# Altium project ProjetX.PrjPcb
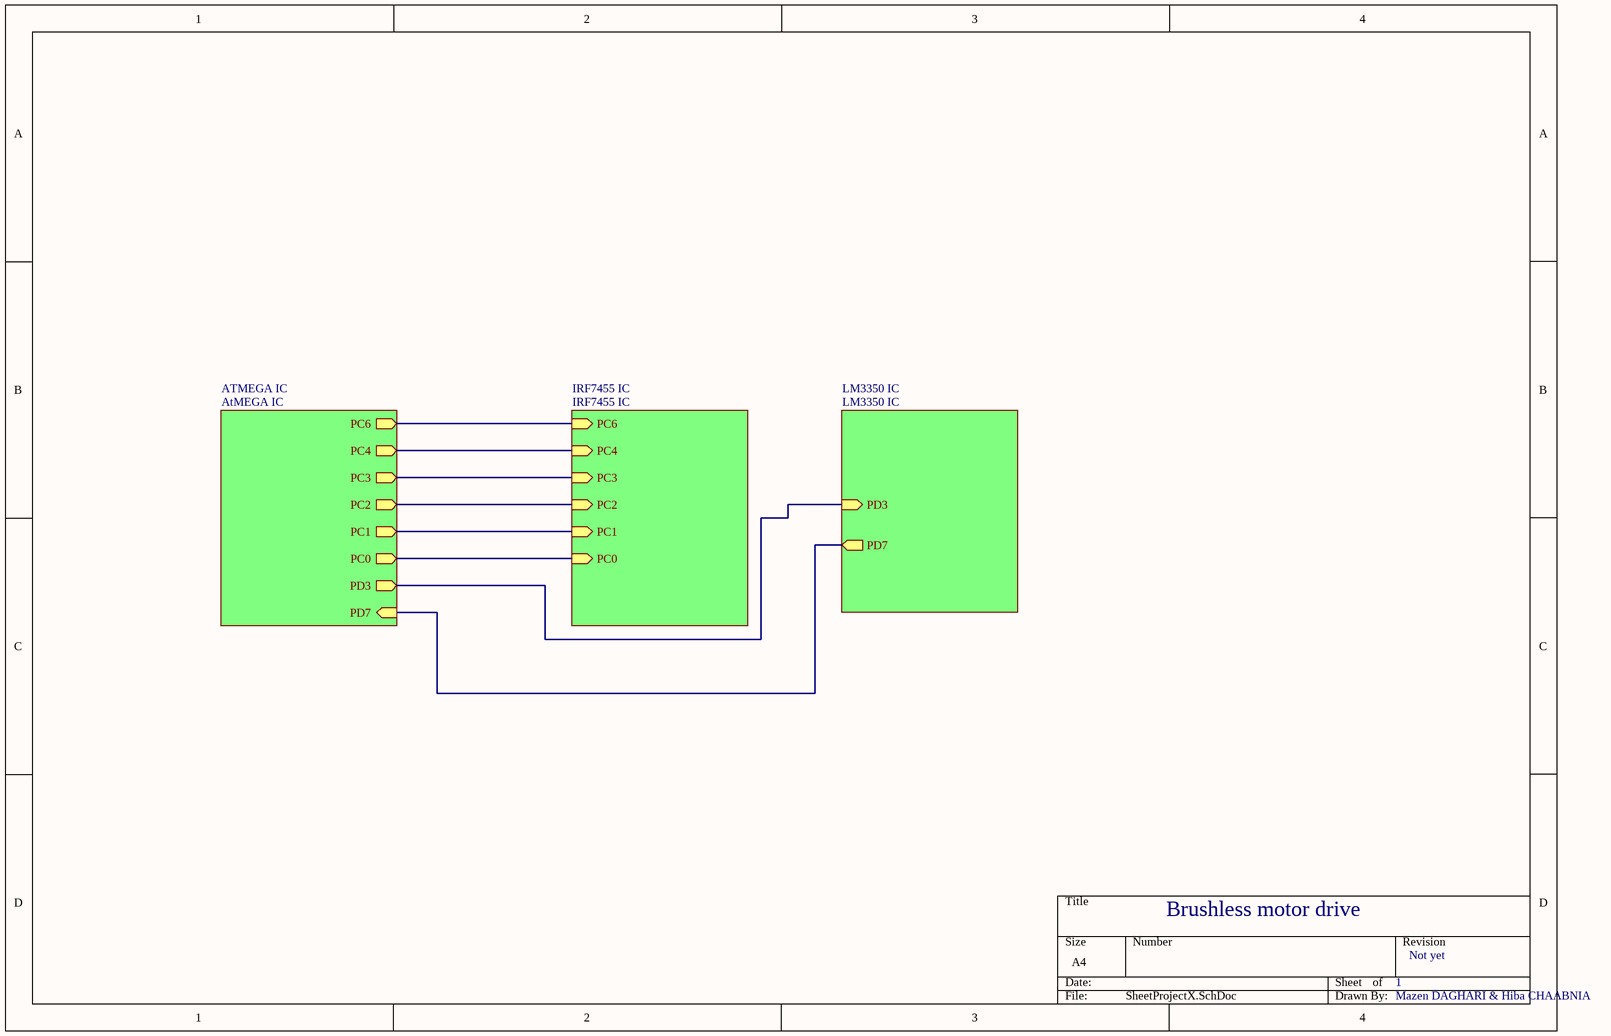
[diagram p0: SheetProjectX.SchDoc]
4 sheets, 57 parts. Net scope: hierarchical (ports join the sheet entries above them; power ports are global).
Board file: PCB3.PcbDoc
Sheets:
  SheetProjectX.SchDoc
    IRF7455 IC = IRF7455 IC.SchDoc
    LM3350 IC = LM3350 IC.SchDoc
    ATMEGA IC = AtMEGA IC.SchDoc

## Sheet SheetProjectX.SchDoc
size A4

### Sub-sheets
ATMEGA IC = AtMEGA IC: PC6 (out), PC4 (out), PC3 (out), PC2 (out), PC1 (out), PC0 (out), PD3 (out), PD7 (in)
IRF7455 IC = IRF7455 IC: PC1 (in), PC6 (in), PC4 (in), PC3 (in), PC2 (in), PC0 (in)
LM3350 IC = LM3350 IC: PD3 (in), PD7 (out)

### Nets
NetC2_18: sheet IRF7455 IC/PC6, sheet ATMEGA IC/PC6
NetC2_20: sheet IRF7455 IC/PC4, sheet ATMEGA IC/PC4
NetC2_21: sheet IRF7455 IC/PC3, sheet ATMEGA IC/PC3
NetC2_22: sheet IRF7455 IC/PC2, sheet ATMEGA IC/PC2
NetC2_23: sheet IRF7455 IC/PC1, sheet ATMEGA IC/PC1
NetC2_24: sheet IRF7455 IC/PC0, sheet ATMEGA IC/PC0
NetC2_31: sheet LM3350 IC/PD3, sheet ATMEGA IC/PD3
NetC4_2: sheet LM3350 IC/PD7, sheet ATMEGA IC/PD7

### Notes on the sheet
- Brushless motor drive
- 1
- Not yet
- Mazen DAGHARI & Hiba CHAABNIA

## Sheet IRF7455 IC.SchDoc
size A4
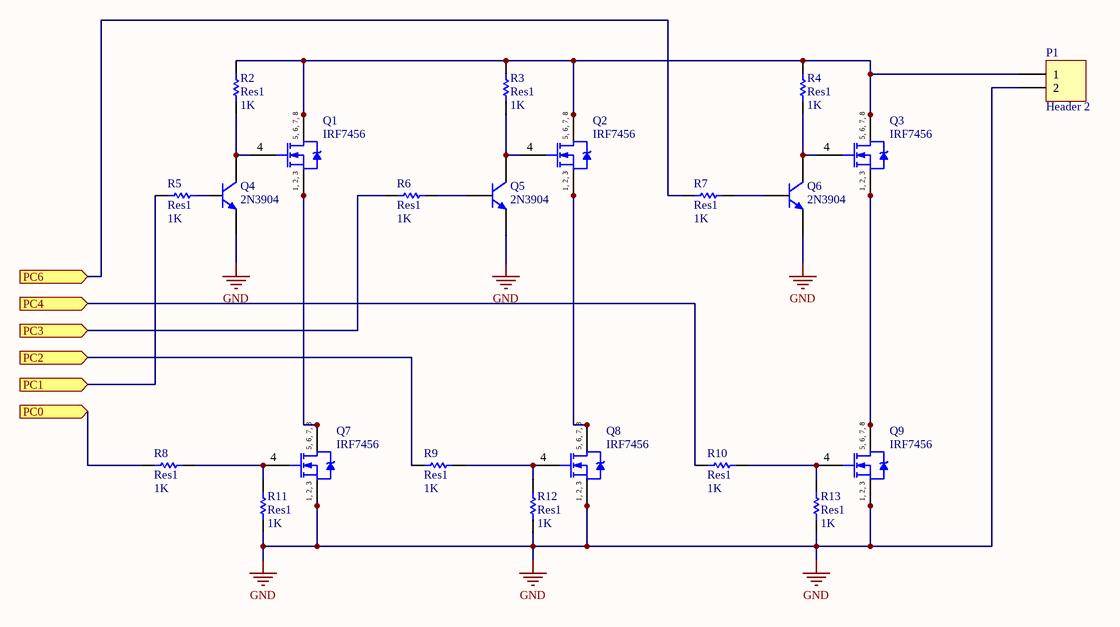
[diagram p1: IRF7455 IC.SchDoc]

### Parts
P1  Header 2  [HDR1X2]
Q1  IRF7456  [SO-8_N]
Q2  IRF7456  [SO-8_N]
Q3  IRF7456  [SO-8_N]
Q4  2N3904  [TO-92A]
Q5  2N3904  [TO-92A]
Q6  2N3904  [TO-92A]
Q7  IRF7456  [SO-8_N]
Q8  IRF7456  [SO-8_N]
Q9  IRF7456  [SO-8_N]
R2  Res1  value 1K  [AXIAL-0.3]
R3  Res1  value 1K  [AXIAL-0.3]
R4  Res1  value 1K  [AXIAL-0.3]
R5  Res1  value 1K  [AXIAL-0.3]
R6  Res1  value 1K  [AXIAL-0.3]
R7  Res1  value 1K  [AXIAL-0.3]
R8  Res1  value 1K  [AXIAL-0.3]
R9  Res1  value 1K  [AXIAL-0.3]
R10  Res1  value 1K  [AXIAL-0.3]
R11  Res1  value 1K  [AXIAL-0.3]
R12  Res1  value 1K  [AXIAL-0.3]
R13  Res1  value 1K  [AXIAL-0.3]

### Ports
PC0 (in), PC1 (in), PC2 (in), PC3 (in), PC4 (in), PC6 (in)

### Nets
GND: P1.2 Q4.1(E) Q5.1(E) Q6.1(E) Q7.1(S) Q7.2(S) Q7.3(S) Q8.1(S) Q8.2(S) Q8.3(S) Q9.1(S) Q9.2(S) Q9.3(S) R11.1 R12.1 R13.1
NetC2_18: R7.2 ; port PC6
NetC2_20: R10.2 ; port PC4
NetC2_21: R6.2 ; port PC3
NetC2_22: R9.2 ; port PC2
NetC2_23: R5.2 ; port PC1
NetC2_24: R8.2 ; port PC0
NetP1_1: P1.1 Q1.5(D) Q1.6(D) Q1.7(D) Q1.8(D) Q2.5(D) Q2.6(D) Q2.7(D) Q2.8(D) Q3.5(D) Q3.6(D) Q3.7(D) Q3.8(D) R2.2 R3.2 R4.2
NetQ1_1: Q1.1(S) Q1.2(S) Q1.3(S) Q7.5(D) Q7.6(D) Q7.7(D) Q7.8(D)
NetQ1_4: Q1.4(G) Q4.3(C) R2.1
NetQ2_1: Q2.1(S) Q2.2(S) Q2.3(S) Q8.5(D) Q8.6(D) Q8.7(D) Q8.8(D)
NetQ2_4: Q2.4(G) Q5.3(C) R3.1
NetQ3_1: Q3.1(S) Q3.2(S) Q3.3(S) Q9.5(D) Q9.6(D) Q9.7(D) Q9.8(D)
NetQ3_4: Q3.4(G) Q6.3(C) R4.1
NetQ4_2: Q4.2(B) R5.1
NetQ5_2: Q5.2(B) R6.1
NetQ6_2: Q6.2(B) R7.1
NetQ7_4: Q7.4(G) R8.1 R11.2
NetQ8_4: Q8.4(G) R9.1 R12.2
NetQ9_4: Q9.4(G) R10.1 R13.2

### Notes on the sheet
- (in symbol IRF7456) 5, 6, 7, 8; 1, 2, 3

### Library data of the parts
P1 = Header 2: Header, 2-Pin; LatestRevisionDate: 17-Jul-2002; LatestRevisionNote: Re-released for DXP Platform.; Publisher: Altium Limited
Q1-Q3 Q7-Q9 = IRF7456: HEXFET Power MOSFET; Published: 17-Sep-2003; LatestRevisionDate: 13-Apr-2006; LatestRevisionNote: IPC-7351 Footprint Added.; DatasheetVersion: 20-Apr-2000; PackageVersion: Feb-2001; PackageReference: SO-8; Publisher: Altium Limited; PackageDescription: 8-Pin Plastic Small Outline Integrated Circuit 1.27 mm Pitch; Code_JEDEC: MS-012-AA; Code_IPC: SOIC127P600-8; ComponentLink1Description: Manufacturer Link; ComponentLink1URL: http://www.irf.com/; ComponentLink2Description: Datasheet; ComponentLink2URL: http://www.irf.com/product-info/datasheets/data/irf7456.pdf
Q4-Q6 = 2N3904: NPN General Purpose Amplifier; Published: 8-Jun-2000; LatestRevisionDate: 15-Jan-2003; LatestRevisionNote: PCB Footprint 'BCY-W3/D4.7' replaced; DatasheetVersion: 1997; PackageVersion: Sep-1998; PackageReference: TO-92A; Publisher: Altium Limited; PackageDescription: TO, Flat Index; 3 In-Line, Axial Leads; Body Dia. 4.5mm; Leads 0.51 x 0.48 mm (max); ComponentLink1Description: Manufacturer Link; ComponentLink1URL: http://www.fairchildsemi.com/; ComponentLink2Description: Datasheet; ComponentLink2URL: http://www.fairchildsemi.com/ds/2N%2F2N3904.pdf
R2-R13 = Res1: Resistor; Published: 8-Jun-2000; LatestRevisionDate: 17-Jul-2002; LatestRevisionNote: Re-released for DXP Platform.; PackageReference: AXIAL-0.3; Publisher: Altium Limited; PackageDescription: Axial Device, Thru-Hole; 2 Leads; 0.3 in Pin Spacing

## Sheet LM3350 IC.SchDoc
size A4
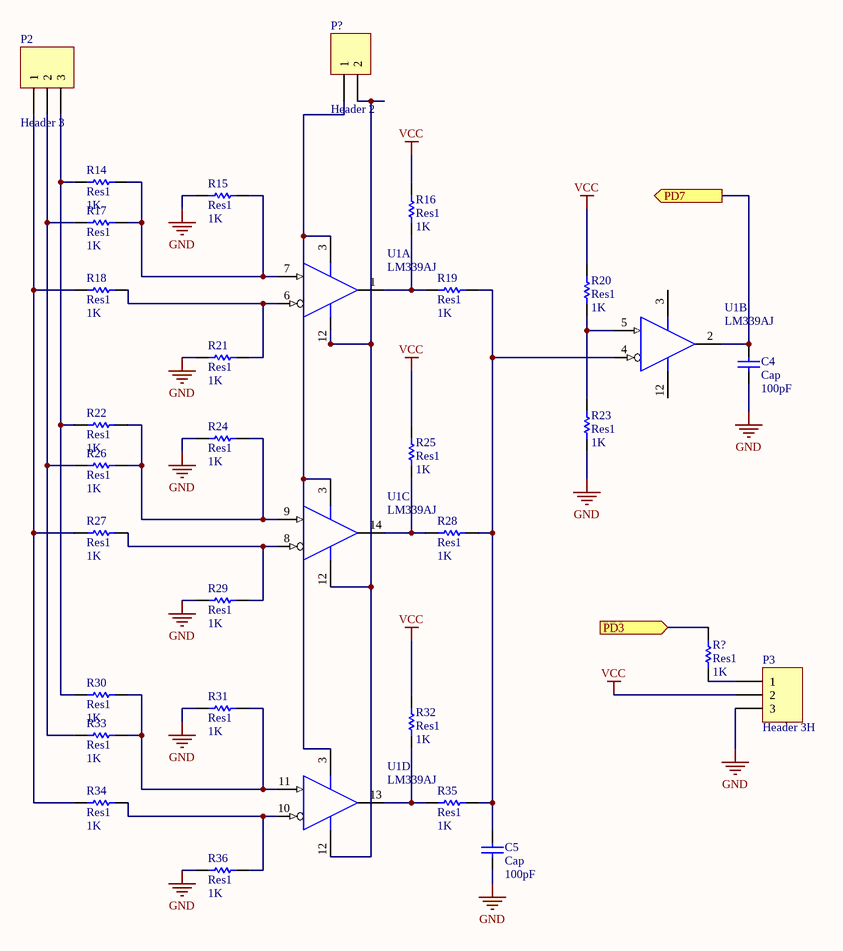
[diagram p2: LM3350 IC.SchDoc]

### Parts
C4  Cap  value 100pF  [RAD-0.3]
C5  Cap  value 100pF  [RAD-0.3]
P2  Header 3  [HDR1X3]
P3  Header 3H  [HDR1X3H]
P?  Header 2  [HDR1X2]
R14  Res1  value 1K  [AXIAL-0.3]
R15  Res1  value 1K  [AXIAL-0.3]
R16  Res1  value 1K  [AXIAL-0.3]
R17  Res1  value 1K  [AXIAL-0.3]
R18  Res1  value 1K  [AXIAL-0.3]
R19  Res1  value 1K  [AXIAL-0.3]
R20  Res1  value 1K  [AXIAL-0.3]
R21  Res1  value 1K  [AXIAL-0.3]
R22  Res1  value 1K  [AXIAL-0.3]
R23  Res1  value 1K  [AXIAL-0.3]
R24  Res1  value 1K  [AXIAL-0.3]
R25  Res1  value 1K  [AXIAL-0.3]
R26  Res1  value 1K  [AXIAL-0.3]
R27  Res1  value 1K  [AXIAL-0.3]
R28  Res1  value 1K  [AXIAL-0.3]
R29  Res1  value 1K  [AXIAL-0.3]
R30  Res1  value 1K  [AXIAL-0.3]
R31  Res1  value 1K  [AXIAL-0.3]
R32  Res1  value 1K  [AXIAL-0.3]
R33  Res1  value 1K  [AXIAL-0.3]
R34  Res1  value 1K  [AXIAL-0.3]
R35  Res1  value 1K  [AXIAL-0.3]
R36  Res1  value 1K  [AXIAL-0.3]
R?  Res1  value 1K  [AXIAL-0.3]
U1  LM339AJ  [J014]  (parts A,B,C,D of 4)

### Ports
PD3 (in), PD7 (out)

### Nets
GND: C4.1 C5.1 P3.3 R15.1 R21.1 R23.1 R24.1 R29.1 R31.1 R36.1
VCC: P3.2 R16.2 R20.2 R25.2 R32.2
NetC2_31: R?.2 ; port PD3
NetC4_2: C4.2 U1.2(OUT) ; port PD7
NetC5_2: C5.2 R19.2 R28.2 R35.2 U1.4(IN-)
NetP2_1: P2.1 R18.1 R27.1 R34.1
NetP2_2: P2.2 R17.1 R26.1 R33.1
NetP2_3: P2.3 R14.1 R22.1 R30.1
NetP3_1: P3.1 R?.1
NetP?_1: P?.1 U1.3(VCC)
NetP?_2: P?.2 U1.12(GND)
NetR14_2: R14.2 R15.2 R17.2 U1.7(IN+)
NetR16_1: R16.1 R19.1 U1.1(OUT)
NetR18_2: R18.2 R21.2 U1.6(IN-)
NetR20_1: R20.1 R23.2 U1.5(IN+)
NetR22_2: R22.2 R24.2 R26.2 U1.9(IN+)
NetR25_1: R25.1 R28.1 U1.14(OUT)
NetR27_2: R27.2 R29.2 U1.8(IN-)
NetR30_2: R30.2 R31.2 R33.2 U1.11(IN+)
NetR32_1: R32.1 R35.1 U1.13(OUT)
NetR34_2: R34.2 R36.2 U1.10(IN-)

### Library data of the parts
C4 C5 = Cap: Capacitor; Published: 8-Jun-2000; LatestRevisionDate: 17-Jul-2002; LatestRevisionNote: Re-released for DXP Platform.; PackageReference: RAD-0.3; Publisher: Altium Limited; PackageDescription: Radial Cap, Thru-Hole; 2 Leads; 0.3 in Pin Spacing
P2 = Header 3: Header, 3-Pin; LatestRevisionDate: 17-Jul-2002; LatestRevisionNote: Re-released for DXP Platform.; Publisher: Altium Limited
P3 = Header 3H: Header, 3-Pin, Right Angle; LatestRevisionDate: 17-Jul-2002; LatestRevisionNote: Re-released for DXP Platform.; Publisher: Altium Limited
P? = Header 2: Header, 2-Pin; LatestRevisionDate: 17-Jul-2002; LatestRevisionNote: Re-released for DXP Platform.; Publisher: Altium Limited
R14-R36 R? = Res1: Resistor; Published: 8-Jun-2000; LatestRevisionDate: 17-Jul-2002; LatestRevisionNote: Re-released for DXP Platform.; PackageReference: AXIAL-0.3; Publisher: Altium Limited; PackageDescription: Axial Device, Thru-Hole; 2 Leads; 0.3 in Pin Spacing
U1 = LM339AJ: Quad Differential Comparator; Published: 15-Apr-2002; LatestRevisionDate: 04-Mar-2005; LatestRevisionNote: Stylized 3D Model Added.; DatasheetVersion: Apr-1988; PackageVersion: Jun-1999; PackageReference: J014; Publisher: Altium Limited; PackageDescription: DIP; 14 Leads; Row Spacing 7.62 mm; Pitch 2.54 mm; ComponentLink1Description: Manufacturer Link; ComponentLink1URL: http://www.ti.com/; ComponentLink2Description: Datasheet; ComponentLink2URL: http://www-s.ti.com/sc/ds/lm139a.pdf

## Sheet AtMEGA IC.SchDoc
size A4
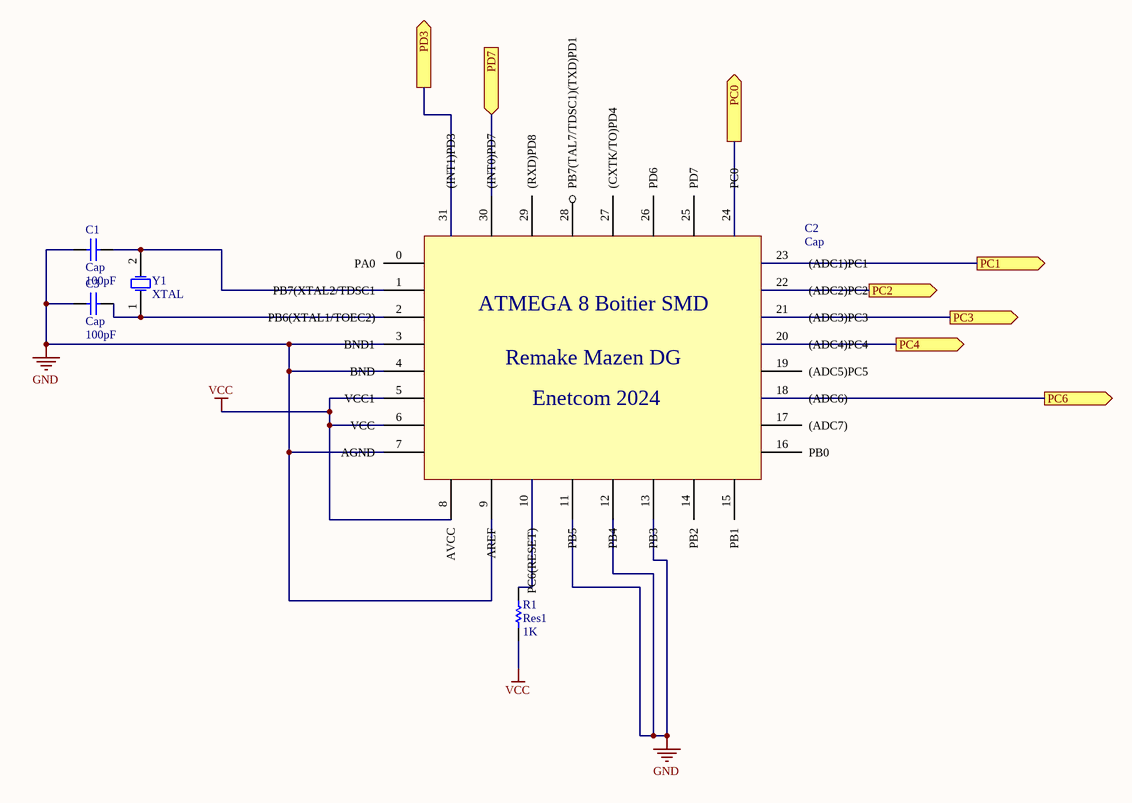
[diagram p3: AtMEGA IC.SchDoc]

### Parts
C1  Cap  value 100pF  [RAD-0.3]
C2  Cap  [Atmega_MAZENKOVIC]
C3  Cap  value 100pF  [RAD-0.3]
R1  Res1  value 1K  [AXIAL-0.3]
Y1  XTAL  [R38]

### Ports
PC0 (out), PC1 (out), PC2 (out), PC3 (out), PC4 (out), PC6 (out), PD3 (out), PD7 (in)

### Nets
GND: C1.1 C3.1
VCC: R1.1
NetC1_2: C1.2 Y1.2(OSC2)
NetC2_10: C2.10(PC6(RESET)) R1.2
NetC2_18: C2.18((ADC6)) ; port PC6
NetC2_20: C2.20((ADC4)PC4) ; port PC4
NetC2_21: C2.21((ADC3)PC3) ; port PC3
NetC2_22: C2.22((ADC2)PC2) ; port PC2
NetC2_23: C2.23((ADC1)PC1) ; port PC1
NetC2_24: C2.24(PC0) ; port PC0
NetC2_31: C2.31((INT1)PD3) ; port PD3
NetC3_2: C3.2 Y1.1(OSC1)

Not connected (* = marked no-connect by the designer): C2 0(PA0) 1(PB7(XTAL2/TDSC1) 2(PB6(XTAL1/TOEC2)) 3(BND1) 4(BND) 5(VCC1) 6(VCC) 7(AGND) 8(AVCC) 9(AREF) 11(PB5) 12(PB4) 13(PB3) 14(PB2) 15(PB1) 16(PB0) 17((ADC7)) 19((ADC5)PC5) 25(PD7) 26(PD6) 27((CXTK/TO)PD4) 28(PB7(TAL7/TDSC1)(TXD)PD1) 29((RXD)PD8) 30((INT0)PD7)

### Notes on the sheet
- (in symbol Component_1) ATMEGA 8 Boitier SMD; Remake Mazen DG; Enetcom 2024

### Library data of the parts
C1 C3 = Cap: Capacitor; Published: 8-Jun-2000; LatestRevisionDate: 17-Jul-2002; LatestRevisionNote: Re-released for DXP Platform.; PackageReference: RAD-0.3; Publisher: Altium Limited; PackageDescription: Radial Cap, Thru-Hole; 2 Leads; 0.3 in Pin Spacing
C2 = Component_1: Capacitor; Published: 4-Mai-2024; LatestRevisionDate: 17-Jul-2002; LatestRevisionNote: Re-released for DXP Platform.; PackageReference: RAD-0.3; Publisher: Altium Limited; PackageDescription: Radial Cap, Thru-Hole; 2 Leads; 0.3 in Pin Spacing
R1 = Res1: Resistor; Published: 8-Jun-2000; LatestRevisionDate: 17-Jul-2002; LatestRevisionNote: Re-released for DXP Platform.; PackageReference: AXIAL-0.3; Publisher: Altium Limited; PackageDescription: Axial Device, Thru-Hole; 2 Leads; 0.3 in Pin Spacing
Y1 = XTAL: Crystal Oscillator; Published: 8-Jun-2000; LatestRevisionDate: 17-Jul-2002; LatestRevisionNote: Re-released for DXP Platform.; PackageReference: R38; Publisher: Altium Limited; PackageDescription: Crystal, Thru-Hole; 2 Leads; Body 3.1 x 8.2 mm (Dia.xH)

## Nets that join several sheets
GND: IRF7455 IC (16 pins), LM3350 IC (10 pins), AtMEGA IC (C1.1 C3.1)
VCC: LM3350 IC (5 pins), AtMEGA IC (R1.1)
NetC2_18: IRF7455 IC (R7.2), AtMEGA IC (C2.18)
NetC2_20: IRF7455 IC (R10.2), AtMEGA IC (C2.20)
NetC2_21: IRF7455 IC (R6.2), AtMEGA IC (C2.21)
NetC2_22: IRF7455 IC (R9.2), AtMEGA IC (C2.22)
NetC2_23: IRF7455 IC (R5.2), AtMEGA IC (C2.23)
NetC2_24: IRF7455 IC (R8.2), AtMEGA IC (C2.24)
NetC2_31: LM3350 IC (R?.2), AtMEGA IC (C2.31)